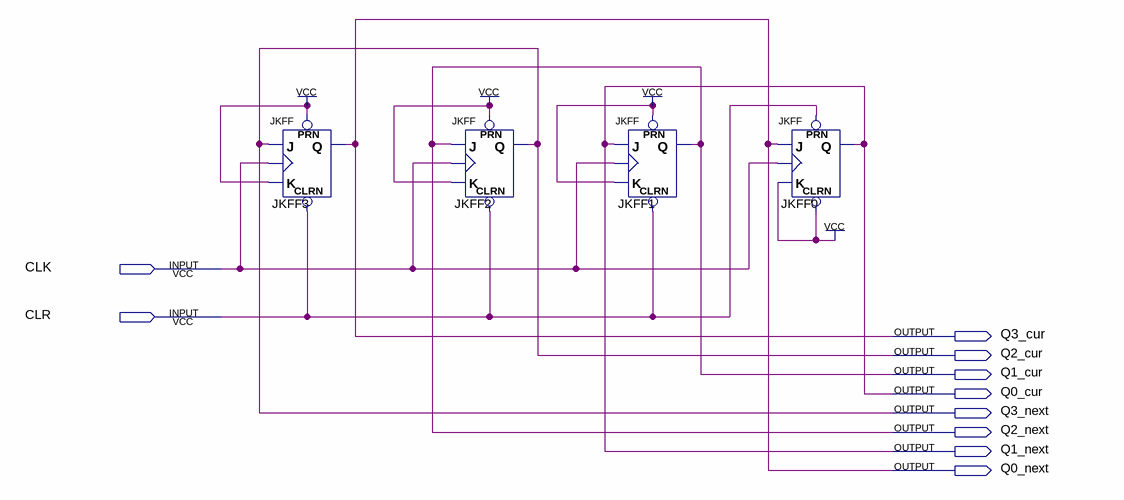
[diagram p0: schematic sheet]
// Quartus schematic one_hot_state_counter.bdf as structural Verilog: 4 symbols, 10 pins
module one_hot_state_counter (
  input  CLK,
  input  CLR,
  output Q3_cur,
  output Q2_cur,
  output Q1_cur,
  output Q0_cur,
  output Q3_next,
  output Q2_next,
  output Q1_next,
  output Q0_next
);

  JKFF JKFF3 (.PRN(1'b1), .CLRN(CLR), .K(1'b1), .J(Q2_cur), .CLK(CLK), .Q(Q0_next));
  JKFF JKFF2 (.PRN(1'b1), .CLRN(CLR), .K(1'b1), .J(Q1_cur), .CLK(CLK), .Q(Q2_cur));
  JKFF JKFF1 (.PRN(1'b1), .CLRN(CLR), .K(1'b1), .J(Q0_cur), .CLK(CLK), .Q(Q1_cur));
  JKFF JKFF0 (.PRN(CLR), .CLRN(1'b1), .K(1'b1), .J(Q0_next), .CLK(CLK), .Q(Q0_cur));

  assign Q1_next = Q0_cur;
  assign Q2_next = Q1_cur;
  assign Q3_cur = Q0_next;
  assign Q3_next = Q2_cur;
endmodule
